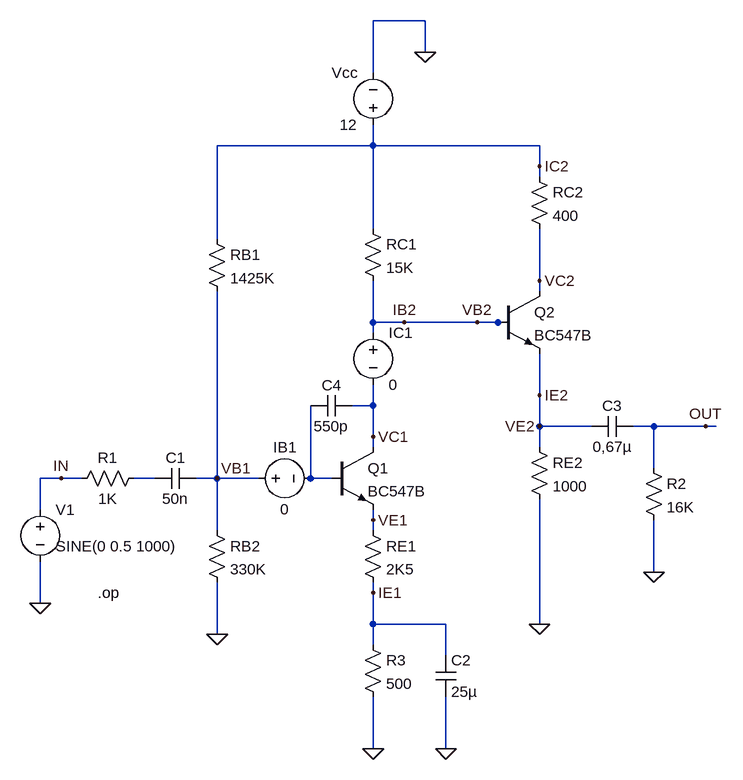
[diagram p0: schematic Simulation.asc]
Simulation.asc, the LTspice schematic file:
Version 4
SHEET 1 1604 680
WIRE 608 -624 528 -624
WIRE 608 -576 608 -624
WIRE 528 -544 528 -624
WIRE 528 -432 528 -464
WIRE 528 -432 288 -432
WIRE 784 -432 528 -432
WIRE 784 -400 784 -432
WIRE 784 -384 784 -400
WIRE 528 -304 528 -432
WIRE 288 -288 288 -432
WIRE 784 -224 784 -304
WIRE 784 -208 784 -224
WIRE 528 -160 528 -224
WIRE 576 -160 528 -160
WIRE 688 -160 576 -160
WIRE 720 -160 688 -160
WIRE 736 -160 720 -160
WIRE 528 -144 528 -160
WIRE 784 -48 784 -112
WIRE 528 -32 528 -64
WIRE 528 -32 496 -32
WIRE 784 0 784 -48
WIRE 864 0 784 0
WIRE 960 0 928 0
WIRE 1040 0 960 0
WIRE 1056 0 1040 0
WIRE 528 16 528 -32
WIRE 528 32 528 16
WIRE 784 32 784 0
WIRE 960 64 960 0
WIRE 48 80 16 80
WIRE 80 80 48 80
WIRE 192 80 160 80
WIRE 288 80 288 -208
WIRE 288 80 256 80
WIRE 352 80 288 80
WIRE 432 80 432 -32
WIRE 464 80 432 80
WIRE 16 128 16 80
WIRE 528 144 528 128
WIRE 288 160 288 80
WIRE 528 160 528 144
WIRE 960 224 960 144
WIRE 528 256 528 240
WIRE 16 272 16 208
WIRE 528 304 528 256
WIRE 640 304 528 304
WIRE 784 304 784 112
WIRE 288 320 288 240
WIRE 528 336 528 304
WIRE 640 352 640 304
WIRE 528 496 528 416
WIRE 640 496 640 416
FLAG 288 320 0
FLAG 528 496 0
FLAG 608 -576 0
FLAG 784 304 0
FLAG 528 144 VE1
FLAG 288 80 VB1
FLAG 784 -224 VC2
FLAG 784 0 VE2
FLAG 688 -160 VB2
FLAG 784 -400 IC2
FLAG 784 -48 IE2
FLAG 576 -160 IB2
FLAG 528 256 IE1
FLAG 528 16 VC1
FLAG 16 272 0
FLAG 960 224 0
FLAG 48 80 IN
FLAG 640 496 0
FLAG 1040 0 OUT
SYMBOL res 272 -304 R0
SYMATTR InstName RB1
SYMATTR Value 1425K
SYMBOL res 272 144 R0
SYMATTR InstName RB2
SYMATTR Value 330K
SYMBOL res 512 144 R0
SYMATTR InstName RE1
SYMATTR Value 2K5
SYMBOL res 512 -320 R0
SYMATTR InstName RC1
SYMATTR Value 15K
SYMBOL voltage 528 -448 R180
WINDOW 0 24 96 Left 2
WINDOW 3 24 16 Left 2
WINDOW 123 0 0 Left 0
WINDOW 39 0 0 Left 0
SYMATTR InstName Vcc
SYMATTR Value 12
SYMBOL res 768 -400 R0
SYMATTR InstName RC2
SYMATTR Value 400
SYMBOL res 768 16 R0
SYMATTR InstName RE2
SYMATTR Value 1000
SYMBOL npn 464 32 R0
SYMATTR InstName Q1
SYMATTR Value BC547B
SYMBOL npn 720 -208 R0
SYMATTR InstName Q2
SYMATTR Value BC547B
SYMBOL voltage 336 80 R270
WINDOW 0 32 56 VTop 2
WINDOW 3 -32 56 VBottom 2
WINDOW 123 0 0 Left 0
WINDOW 39 0 0 Left 0
SYMATTR InstName IB1
SYMATTR Value 0
SYMBOL voltage 528 -160 R0
WINDOW 123 0 0 Left 0
WINDOW 39 0 0 Left 0
SYMATTR InstName IC1
SYMATTR Value 0
SYMBOL voltage 16 112 R0
WINDOW 123 24 44 Left 2
WINDOW 39 0 0 Left 0
WINDOW 3 24 72 Left 2
SYMATTR Value SINE(0 0.5 1000)
SYMATTR InstName V1
SYMBOL res 512 320 R0
SYMATTR InstName R3
SYMATTR Value 500
SYMBOL res 176 64 R90
WINDOW 0 0 56 VBottom 2
WINDOW 3 32 56 VTop 2
SYMATTR InstName R1
SYMATTR Value 1K
SYMBOL res 944 48 R0
SYMATTR InstName R2
SYMATTR Value 16K
SYMBOL cap 256 64 R90
WINDOW 0 0 32 VBottom 2
WINDOW 3 32 32 VTop 2
SYMATTR InstName C1
SYMATTR Value 50n
SYMBOL cap 624 352 R0
SYMATTR InstName C2
SYMATTR Value 25µ
SYMBOL cap 928 -16 R90
WINDOW 0 0 32 VBottom 2
WINDOW 3 32 32 VTop 2
SYMATTR InstName C3
SYMATTR Value 0,67µ
SYMBOL cap 496 -48 R90
WINDOW 0 0 32 VBottom 2
WINDOW 3 32 32 VTop 2
SYMATTR InstName C4
SYMATTR Value 550p
SYMATTR SpiceLine V=50 Irms=0 Rser=0.1122 Lser=324p
TEXT 104 256 Left 2 !.op

The netlist it stands for:
* Simulation.asc
RB1 IC2 VB1 1425K
RB2 VB1 0 330K
RE1 VE1 IE1 2K5
RC1 IC2 IB2 15K
Vcc IC2 0 12
RC2 IC2 VC2 400
RE2 IE2 0 1000
Q1 VC1 N002 VE1 0 BC547B
Q2 VC2 IB2 IE2 0 BC547B
V§IB1 VB1 N002 0
V§IC1 IB2 VC1 0
V1 IN 0 SINE(0 0.5 1000)
R3 IE1 0 500
R1 N001 IN 1K
R2 OUT 0 16K
C1 VB1 N001 50n
C2 IE1 0 25µ
C3 OUT IE2 0,67µ
C4 VC1 N002 550p V=50 Irms=0 Rser=0.1122 Lser=324p
.model NPN NPN
.model PNP PNP
.lib standard.bjt
.op
.backanno
.end